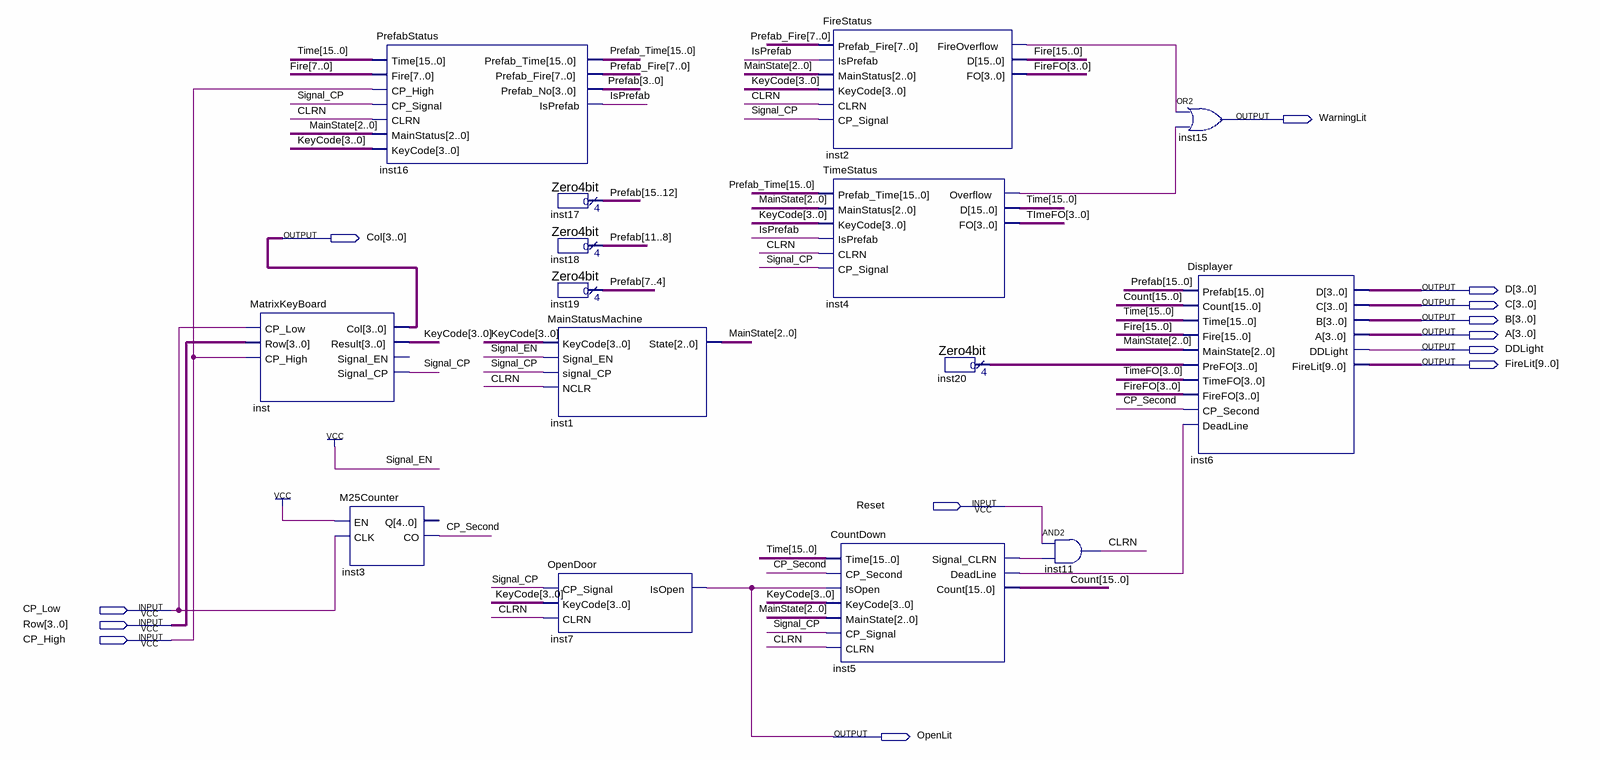
[diagram p0: schematic sheet]
// Quartus schematic Microwave.bdf as structural Verilog: 15 symbols, 13 pins
module Microwave (
  input  Reset,
  input  CP_Low,
  input  [3:0] Row,
  input  CP_High,
  output WarningLit,
  output [3:0] Col,
  output [3:0] D,
  output [3:0] C,
  output [3:0] B,
  output [3:0] A,
  output DDLight,
  output [9:0] FireLit,
  output OpenLit
);

  wire CLRN, CP_Second, inst2_fireoverflow, inst4_overflow, inst5_deadline, inst5_signal_clrn, IsPrefab,
       Signal_CP;
  wire [2:0] MainState;
  wire [3:0] FireFO, inst20_result, KeyCode, TimeFO;
  wire [7:0] Prefab_Fire;
  wire [15:0] Count, Fire, Prefab, Prefab_Time, Time;

  MatrixKeyBoard inst (
    .CP_Low(CP_Low), .Row(Row), .CP_High(CP_High), .Col(Col), .Result(KeyCode), .Signal_CP(Signal_CP));  // open: Signal_EN
  M25Counter inst3 (.EN(1'b1), .CLK(CP_Low), .CO(CP_Second));  // open: Q
  PrefabStatus inst16 (
    .Time(Time), .Fire(Fire[7:0]), .CP_High(CP_High), .CP_Signal(Signal_CP), .CLRN(CLRN),
    .MainStatus(MainState), .KeyCode(KeyCode), .Prefab_Time(Prefab_Time), .Prefab_Fire(Prefab_Fire),
    .Prefab_No(Prefab[3:0]), .IsPrefab(IsPrefab));
  Zero4bit inst17 (.result(Prefab[15:12]));
  Zero4bit inst18 (.result(Prefab[11:8]));
  Zero4bit inst19 (.result(Prefab[7:4]));
  MainStatusMachine inst1 (.KeyCode(KeyCode), .Signal_EN(1'b1), .signal_CP(Signal_CP), .NCLR(CLRN), .State(MainState));
  OpenDoor inst7 (.CP_Signal(Signal_CP), .KeyCode(KeyCode), .CLRN(CLRN), .IsOpen(OpenLit));
  FireStatus inst2 (
    .Prefab_Fire(Prefab_Fire), .IsPrefab(IsPrefab), .MainStatus(MainState), .KeyCode(KeyCode), .CLRN(CLRN),
    .CP_Signal(Signal_CP), .FireOverflow(inst2_fireoverflow), .D(Fire), .FO(FireFO));
  TimeStatus inst4 (
    .Prefab_Time(Prefab_Time), .MainStatus(MainState), .KeyCode(KeyCode), .IsPrefab(IsPrefab), .CLRN(CLRN),
    .CP_Signal(Signal_CP), .Overflow(inst4_overflow), .D(Time), .FO(TimeFO));
  CountDown inst5 (
    .Time(Time), .CP_Second(CP_Second), .IsOpen(OpenLit), .KeyCode(KeyCode), .MainState(MainState),
    .CP_Signal(Signal_CP), .CLRN(CLRN), .Signal_CLRN(inst5_signal_clrn), .DeadLine(inst5_deadline),
    .Count(Count));
  Zero4bit inst20 (.result(inst20_result));
  and inst11 (CLRN, Reset, inst5_signal_clrn);
  or inst15 (WarningLit, inst2_fireoverflow, inst4_overflow);
  Displayer inst6 (
    .Prefab(Prefab), .Count(Count), .Time(Time), .Fire(Fire), .MainState(MainState), .PreFO(inst20_result),
    .TimeFO(TimeFO), .FireFO(FireFO), .CP_Second(CP_Second), .DeadLine(inst5_deadline), .D(D), .C(C), .B(B),
    .A(A), .DDLight(DDLight), .FireLit(FireLit));
endmodule
